# Altium project FT2232HL.PrjPcb
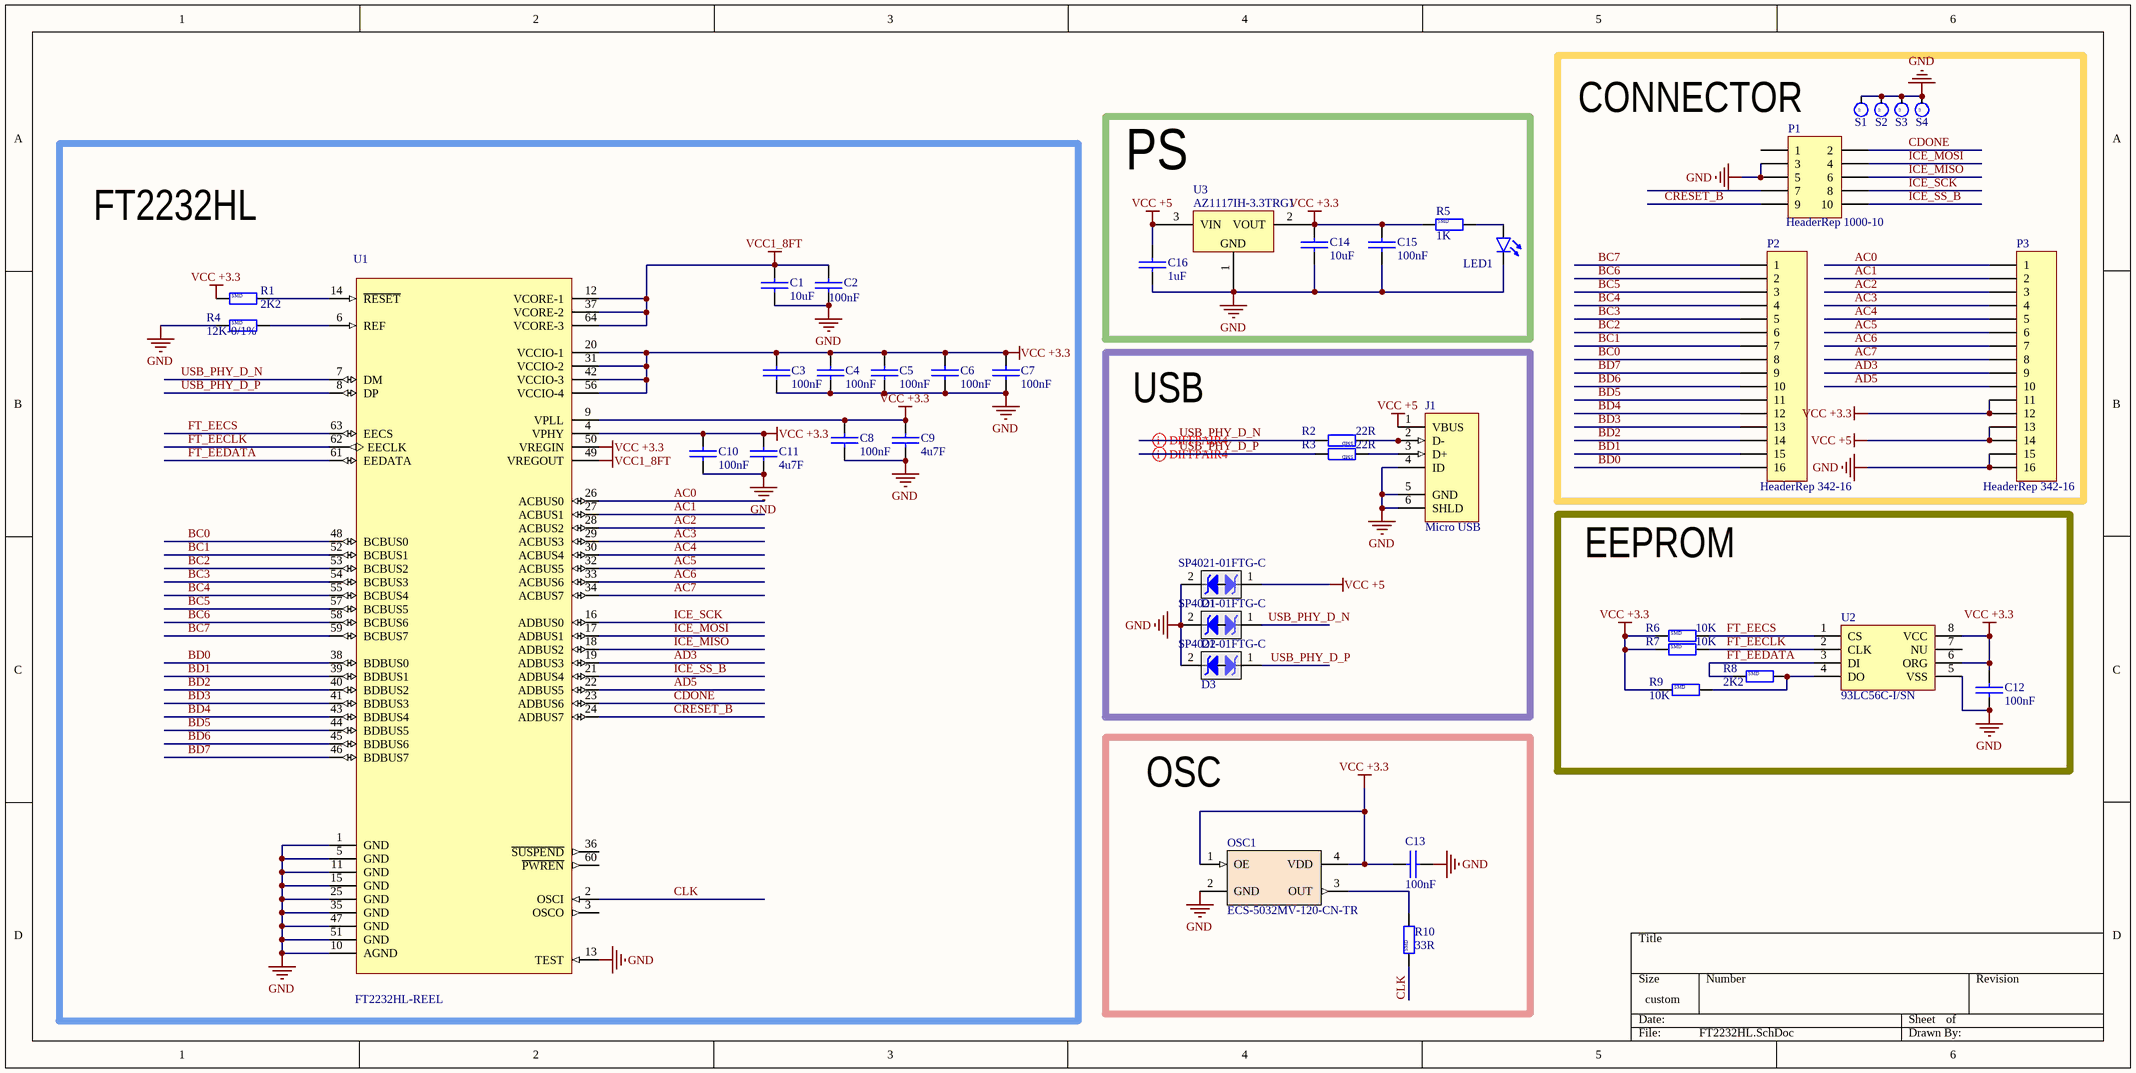
[diagram p0: FT2232HL.SchDoc]
1 sheet, 42 parts. Net scope: global (net labels, ports and power ports of the same name join across sheets).
Board file: FT2232HL.PcbDoc

## Sheet FT2232HL.SchDoc
size 400 x 199 mm

### Parts
C1  10uF  [SMD-0603]
C2  100nF  [SMD-0603]
C3  100nF  [SMD-0603]
C4  100nF  [SMD-0603]
C5  100nF  [SMD-0603]
C6  100nF  [SMD-0603]
C7  100nF  [SMD-0603]
C8  100nF  [SMD-0603]
C9  4u7F  [SMD-0603]
C10  100nF  [SMD-0603]
C11  4u7F  [SMD-0603]
C12  100nF  [SMD-0603]
C13  100nF  [SMD-0603]
C14  10uF  [SMD-0603]
C15  100nF  [SMD-0603]
C16  1uF  [SMD-0603]
D1  SP4021-01FTG-C  [SOD-323-A]
D2  SP4021-01FTG-C  [SOD-323-A]
D3  SP4021-01FTG-C  [SOD-323-A]
J1  Micro USB  [USB-MICRO-B-RIGHT]
LED1  Blue  [SMD-0603]  (value not drawn)
OSC1  ECS-5032MV-120-CN-TR  [5x3.2mm-4Pin]
P1  HeaderRep 1000-10  [HDR2X5-SMD-1.27mm-MALE]
P2  HeaderRep 342-16  [HDR1X16]
P3  HeaderRep 342-16  [HDR1X16]
R1  2K2  [SMD-0603]
R2  22R  [SMD-0603]
R3  22R  [SMD-0603]
R4  12K-0/1%  [SMD-0603]
R5  1K  [SMD-0603]
R6  10K  [SMD-0603]
R7  10K  [SMD-0603]
R8  2K2  [SMD-0603]
R9  10K  [SMD-0603]
R10  33R  [SMD-0603]
S1  NC  [Vebko_Spacers-0002-10]  (value not drawn)
S2  NC  [Vebko_Spacers-0002-10]  (value not drawn)
S3  NC  [Vebko_Spacers-0002-10]  (value not drawn)
S4  NC  [Vebko_Spacers-0002-10]  (value not drawn)
U1  FT2232HL-REEL  [LQFP64]
U2  93LC56C-I/SN  [SO-8]
U3  AZ1117IH-3.3TRG1  [SOT-223]

### Blocks framed on the sheet
CONNECTOR: P1-P3 S1-S4
PS: C14-C16 LED1 R5 U3
FT2232HL: C1-C11 R1 R4 U1
USB: D1-D3 J1 R2 R3
EEPROM: C12 R6-R9 U2
OSC: C13 OSC1 R10

### Nets
GND: C1.1(+) C2.1(+) C3.1(+) C4.1(+) C5.1(+) C6.1(+) C7.1(+) C8.1(+) C9.1(+) C10.1(+) C11.1(+) C12.1(+) C13.2(-) C14.2(-) C15.2(-) C16.2(-) D1.2 D2.2 D3.2 J1.4(ID) J1.5(GND) J1.6(SHLD) LED1.2(K) OSC1.2(GND) P1.3 P1.5 P3.15 P3.16 R4.1 S1.1 S2.1 S3.1 S4.1 U1.1(GND) U1.5(GND) U1.10(AGND) U1.11(GND) U1.13(TEST) U1.15(GND) U1.25(GND) U1.35(GND) U1.47(GND) U1.51(GND) U2.5(VSS) U3.1(GND)
VCC1_8FT: C1.2(-) C2.2(-) U1.12(VCORE-1) U1.37(VCORE-2) U1.49(VREGOUT) U1.64(VCORE-3)
VCC +3.3: C3.2(-) C4.2(-) C5.2(-) C6.2(-) C7.2(-) C8.2(-) C9.2(-) C10.2(-) C11.2(-) C12.2(-) C13.1(+) C14.1(+) C15.1(+) OSC1.1(OE) OSC1.4(VDD) P3.11 P3.12 R1.1 R5.1 R6.1 R7.1 R9.1 U1.4(VPHY) U1.9(VPLL) U1.20(VCCIO-1) U1.31(VCCIO-2) U1.42(VCCIO-3) U1.50(VREGIN) U1.56(VCCIO-4) U2.6(ORG) U2.8(VCC) U3.2(VOUT)
VCC +5: C16.1(+) D1.1 J1.1(VBUS) P3.13 P3.14 U3.3(VIN)
AC0: P3.1 U1.26(ACBUS0)
AC1: P3.2 U1.27(ACBUS1)
AC2: P3.3 U1.28(ACBUS2)
AC3: P3.4 U1.29(ACBUS3)
AC4: P3.5 U1.30(ACBUS4)
AC5: P3.6 U1.32(ACBUS5)
AC6: P3.7 U1.33(ACBUS6)
AC7: P3.8 U1.34(ACBUS7)
AD3: P3.9 U1.19(ADBUS3)
AD5: P3.10 U1.22(ADBUS5)
BC0: P2.8 U1.48(BCBUS0)
BC1: P2.7 U1.52(BCBUS1)
BC2: P2.6 U1.53(BCBUS2)
BC3: P2.5 U1.54(BCBUS3)
BC4: P2.4 U1.55(BCBUS4)
BC5: P2.3 U1.57(BCBUS5)
BC6: P2.2 U1.58(BCBUS6)
BC7: P2.1 U1.59(BCBUS7)
BD0: P2.16 U1.38(BDBUS0)
BD1: P2.15 U1.39(BDBUS1)
BD2: P2.14 U1.40(BDBUS2)
BD3: P2.13 U1.41(BDBUS3)
BD4: P2.12 U1.43(BDBUS4)
BD5: P2.11 U1.44(BDBUS5)
BD6: P2.10 U1.45(BDBUS6)
BD7: P2.9 U1.46(BDBUS7)
CDONE: P1.2 U1.23(ADBUS6)
CLK: R10.1 U1.2(OSCI)
CRESET_B: P1.9 U1.24(ADBUS7)
FT_EECLK: R7.2 U1.62(EECLK) U2.2(CLK)
FT_EECS: R6.2 U1.63(EECS) U2.1(CS)
FT_EEDATA: R8.1 U1.61(EEDATA) U2.3(DI)
ICE_MISO: P1.6 U1.18(ADBUS2)
ICE_MOSI: P1.4 U1.17(ADBUS1)
ICE_SCK: P1.8 U1.16(ADBUS0)
ICE_SS_B: P1.10 U1.21(ADBUS4)
USB_PHY_D_N: D2.1 R2.2 U1.7(DM)
USB_PHY_D_P: D3.1 R3.2 U1.8(DP)
NetJ1_2: J1.2(D-) R2.1
NetJ1_3: J1.3(D+) R3.1
NetLED1_1: LED1.1(A) R5.2
NetOSC1_3: OSC1.3(OUT) R10.2
NetR1_2: R1.2 U1.14(~{RESET})
NetR4_2: R4.2 U1.6(REF)
NetR8_2: R8.2 R9.2 U2.4(DO)

Not connected (* = marked no-connect by the designer): P1 1 7; U1 3(OSCO) 36(~{SUSPEND}) 60(~{PWREN}); U2 7(NU)

### Layout directives
differential pair; differential pair class DIFFPAIR4: USB_PHY_D_N, USB_PHY_D_P

### Notes on the sheet
- (in symbol Resistor SMD) SMD
- (in symbol Spacer) SP

### Library data of the parts
C1-C16 = Normal: Bipolar Capacitor; Designer: Saeid Jorablo; Organazation: ControTec; Adding Date: 1387/12/20
  C1 C14: Value: 10uF
  C2-C8 C10 C12 C13 C15: Value: 100nF
  C9 C11: Value: 4u7F
  C16: Value: 1uF
D1-D3 = SP4000: SP4020 Series 2.5pF, 30A Discrete TVS Diode; Value: 9.1V; Published: 8-Jun-2000; LatestRevisionDate: 17-Jul-2002; LatestRevisionNote: Re-released for DXP Platform.; PackageReference: DIODE-0.7; Publisher: Altium Limited; PackageDescription: Diode, Thru-Hole; 2 Leads; 0.7 in Pin Spacing
LED1 = LED: Designer: Saeid Jorablo; Organazation: ControTec; Adding Date: 1387/12/22; Size: SMD 0805
OSC1 = Oscillator: Value: 50MHZ
P1 = Header 5X2: Header, 5-Pin, Dual row; LatestRevisionDate: 17-Jul-2002; LatestRevisionNote: Re-released for DXP Platform.; Publisher: Altium Limited
P2 P3 = Header 16: Header, 16-Pin; LatestRevisionDate: 17-Jul-2002; LatestRevisionNote: Re-released for DXP Platform.; Publisher: Altium Limited
R1-R10 = Resistor SMD: Resistor; Published: 8-Jun-2000; LatestRevisionDate: 17-Jul-2002; LatestRevisionNote: Re-released for DXP Platform.; PackageReference: AXIAL-0.4; Publisher: Altium Limited; PackageDescription: Axial Device, Thru-Hole; 2 Leads; 0.4 in Pin Spacing
  R1 R8: Value: 2K2
  R2 R3: Value: 22R
  R4: Value: 12K-0/1%
  R5: Value: 1K
  R6 R7 R9: Value: 10K
  R10: Value: 33R
S1-S4 = Spacer: Designer: Saeid Jorablo; Company: IPA Co; Adding Date: 1388/04/05; Color: Blue; Diameter: 1.0 mm; FootPrint: PAD 3.5
U1 = FT2232HL-REEL: Dual High Speed USB UART/FIFO IC LQFP64; MF: FTDI, Future; Package: LQFP-64 FTDI; MP: FT2232HL; Price: None; SnapEDA_Link: https://www.snapeda.com/parts/FT2232HL/FTDI%2C%20Future%20Technology%20Devices%20International%20Ltd/view-part/497842/?ref=snap; Availability: Unavailable; Value: *
U2 = 93LC56
U3 = AZ1117IH: LOW DROP FIXED POSITIVE VOLTAGE REGULATORS